# EAGLE design A10N_TOP (EAGLE 9.6.2)
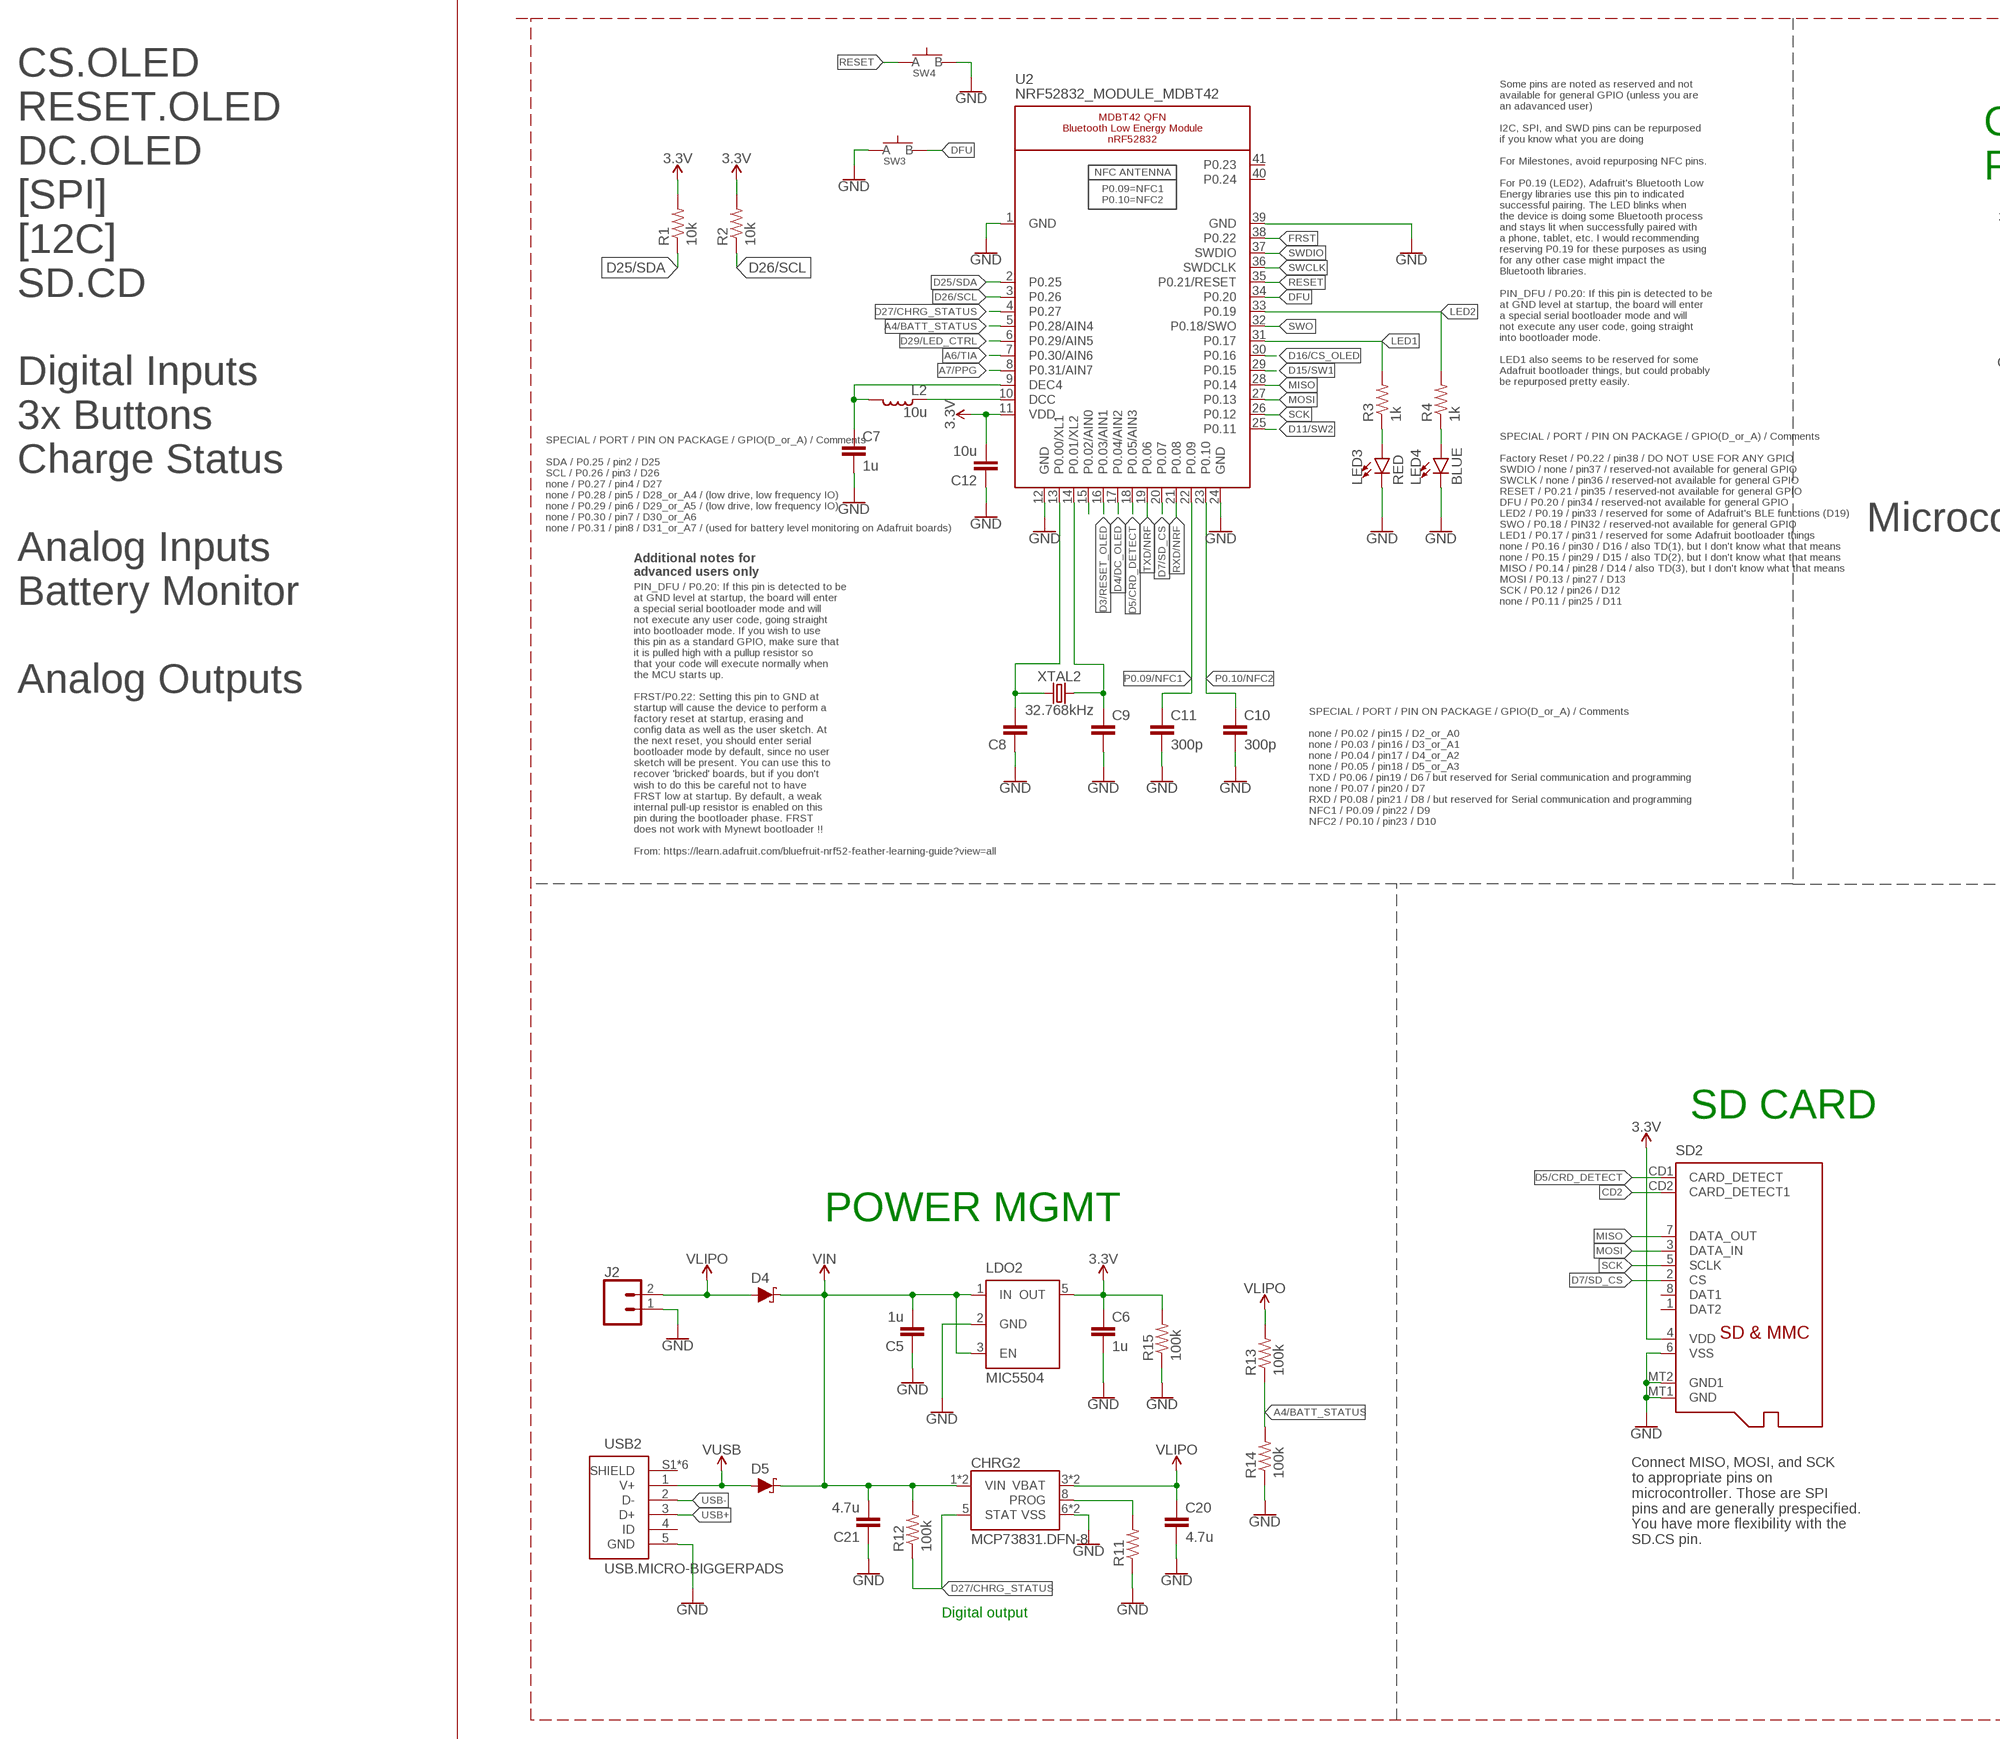
[diagram p0: schematic, sheet 1, part 1 of 2]
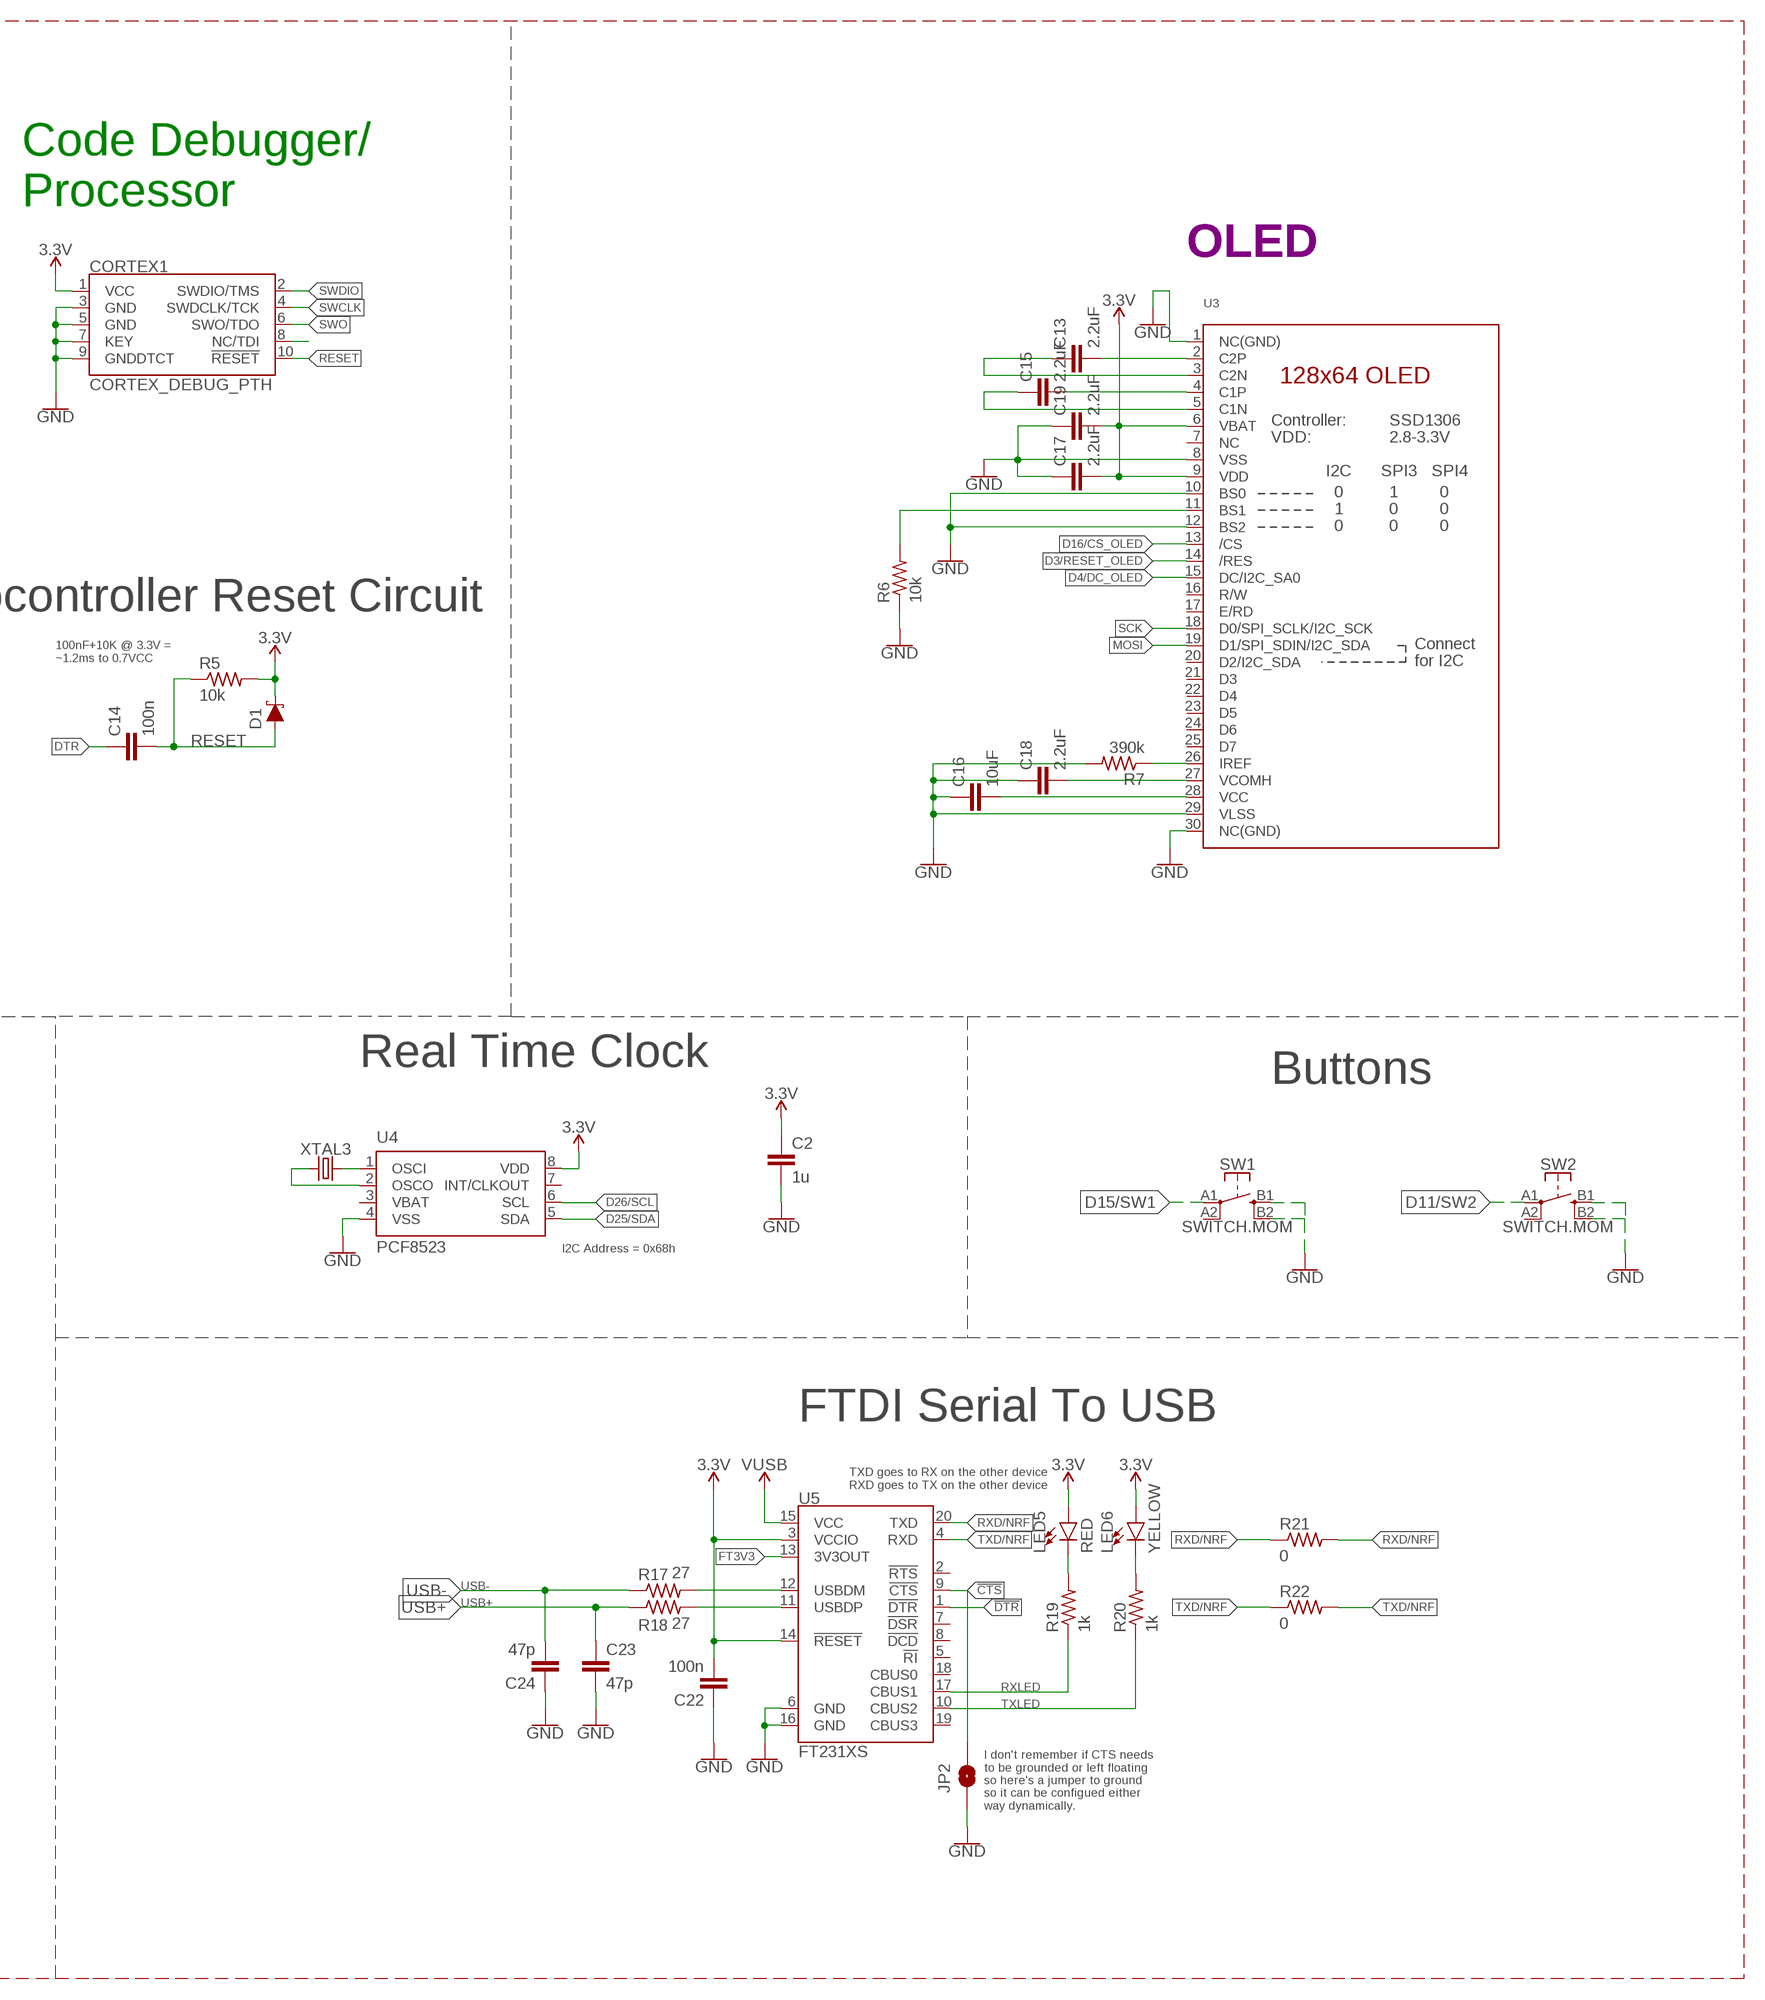
[diagram p1: schematic, sheet 1, part 2 of 2]

## Parts
C2  1u  CAPACITOR0603  [C0603]
C5  1u  CAPACITOR0603  [C0603]
C6  1u  CAPACITOR0603  [C0603]
C7  1u  CAPACITOR0603  [C0603]
C8  CAPACITOR0603  [C0603]
C9  CAPACITOR0603  [C0603]
C10  300p  CAPACITOR0603  [C0603]
C11  300p  CAPACITOR0603  [C0603]
C12  10u  CAPACITOR0805  [C0805]
C13  2.2uF  CAPACITOR0402  [C0402]
C14  100n  CAPACITOR0603  [C0603]
C15  2.2uF  CAPACITOR0402  [C0402]
C16  10uF  CAPACITOR0603  [C0603]
C17  2.2uF  CAPACITOR0402  [C0402]
C18  2.2uF  CAPACITOR0402  [C0402]
C19  2.2uF  CAPACITOR0402  [C0402]
C20  4.7u  CAPACITOR0603  [C0603]
C21  4.7u  CAPACITOR0603  [C0603]
C22  100n  CAPACITOR0603  [C0603]
C23  47p  CAPACITOR0603  [C0603]
C24  47p  CAPACITOR0603  [C0603]
CHRG2  MCP73831.DFN-8  [DFN-8-2X3MM]
CORTEX1  CORTEX_DEBUG_PTH  [2X5-PTH-1.27MM]
D1  SCHOTTKY-USC  [USC]
D4  SCHOTTKY-USC  [USC]
D5  SCHOTTKY-USC  [USC]
J2  CONN_02  [1X02]
JP2  JUMPER-SMT_2_NO_SILK  [SMT-JUMPER_2_NO_SILK]
L2  10u  INDUCTOR0603  [L0603]
LDO2  MIC5504  [SOT23-5@1]
LED3  RED  LED0603  [LED-0603]
LED4  BLUE  LED0603  [LED-0603]
LED5  RED  LED0603  [LED-0603]
LED6  YELLOW  LED0603  [LED-0603]
R1  10k  RESISTOR0603  [R0603]
R2  10k  RESISTOR0603  [R0603]
R3  1k  RESISTOR0603  [R0603]
R4  1k  RESISTOR0603  [R0603]
R5  10k  RESISTOR0603  [R0603]
R6  10k  RESISTOR0603  [R0603]
R7  390k  RESISTOR0603  [R0603]
R11  RESISTOR0603  [R0603]
R12  100k  RESISTOR0603  [R0603]
R13  100k  RESISTOR0603  [R0603]
R14  100k  RESISTOR0603  [R0603]
R15  100k  RESISTOR0603  [R0603]
R17  27  RESISTOR0603  [R0603]
R18  27  RESISTOR0603  [R0603]
R19  1k  RESISTOR0603  [R0603]
R20  1k  RESISTOR0603  [R0603]
R21  0  RESISTOR0603  [R0603]
R22  0  RESISTOR0603  [R0603]
SD2  MICROSD  [MICROSD]
SW1  SWITCH.MOM  [TACTILE_SWITCH_SMD_6.2MM_TALL]
SW2  SWITCH.MOM  [TACTILE_SWITCH_SMD_6.2MM_TALL]
SW3  SPST-PTS830GG140-COPY.1-3  [BUTTON-GULLWING]
SW4  SPST-PTS830GG140-COPY.1-3  [BUTTON-GULLWING]
U2  NRF52832_MODULE_MDBT42  [BLE_MODULE_RAYTAC_MDBT42]
U3  DISP_OLED_UG-2864HSWEG01-NO-WRAPAROUND  [UG-2864HSWEG01_0.96IN_NO-WRAPAROUND]
U4  PCF8523  [SO8]
U5  FT231XS  [SSOP20_L]
USB2  USB.MICRO-BIGGERPADS  [USB-MICRO-01.BIGGERPADS]
XTAL2  32.768kHz  CRYSTALECS-.327-12.5-12-C-TR  [2-SMD.NOLEAD.2.0MMTO1.2MM]
XTAL3  32.7680kHz  CRYSTALECS-.327-12.5-12-C-TR  [2-SMD.NOLEAD.2.0MMTO1.2MM]

## Nets
3.3V: C2.1 C6.1 C12.2 C17.2 C19.2 C22.2 CORTEX1.1(VCC) D1.-(C) LDO2.5(OUT) LED5.A LED6.A R1.2 R2.2 R5.2 R15.2 SD2.4(VDD) U2.11(VDD) U3.6(VBAT) U3.9(VDD) U4.8(VDD) U5.3(VCCIO) U5.14(!RESET)
!CTS: JP2.2 U5.9(!CTS)
!DTR: U5.1(!DTR)
A4/BATT_STATUS: R13.1 R14.2 U2.5(P0.28/AIN4)
A6/TIA: U2.7(P0.30/AIN6)
A7/PPG: U2.8(P0.31/AIN7)
CD2: SD2.CD2(CARD_DETECT1)
D3/RESET_OLED: U2.16(P0.03/AIN1) U3.14(/RES)
D4/DC_OLED: U2.17(P0.04/AIN2) U3.15(DC/I2C_SA0)
D5/CRD_DETECT: SD2.CD1(CARD_DETECT) U2.18(P0.05/AIN3)
D7/SD_CS: SD2.2(CS) U2.20(P0.07)
D11/SW2: SW2.A1 U2.25(P0.11)
D15/SW1: SW1.A1 U2.29(P0.15)
D16/CS_OLED: U2.30(P0.16) U3.13(/CS)
D25/SDA: R1.1 U2.2(P0.25) U4.5(SDA)
D26/SCL: R2.1 U2.3(P0.26) U4.6(SCL)
D27/CHRG_STATUS: CHRG2.5(STAT) R12.1 U2.4(P0.27)
D29/LED_CTRL: U2.6(P0.29/AIN5)
DFU: SW3.3(B) U2.34(P0.20)
DTR: C14.1
FRST: U2.38(P0.22)
FT3V3: U5.13(3V3OUT)
GND: C2.2 C5.1 C6.2 C7.2 C8.1 C9.2 C10.2 C11.2 C12.1 C16.1 C17.1 C18.1 C19.1 C20.2 C21.1 C22.1 C23.2 C24.1 CHRG2.6(VSS) CHRG2.EP(VSS) CORTEX1.3(GND) CORTEX1.5(GND) CORTEX1.7(KEY) CORTEX1.9(GNDDTCT) J2.1 JP2.1 LDO2.2(GND) LED3.C LED4.C R6.1 R7.2 R11.1 R14.1 R15.1 SD2.6(VSS) SD2.MT1(GND) SD2.MT2(GND1) SW1.B1 SW1.B2 SW2.B1 SW2.B2 SW3.1(A) SW4.3(B) U2.1(GND) U2.12(GND) U2.24(GND) U2.39(GND) U3.1(NC(GND)) U3.8(VSS) U3.10(BS0) U3.12(BS2) U3.29(VLSS) U3.30(NC(GND)) U4.4(VSS) U5.6(GND) U5.16(GND) USB2.5(GND)
LED1: R3.2 U2.31(P0.17)
LED2: R4.2 U2.33(P0.19)
MISO: SD2.7(DATA_OUT) U2.28(P0.14)
MOSI: SD2.3(DATA_IN) U2.27(P0.13) U3.19(D1/SPI_SDIN/I2C_SDA)
N$1: R6.2 U3.11(BS1)
N$2: R7.1 U3.26(IREF)
N$3: C13.2 U3.2(C2P)
N$4: C8.2 U2.13(P0.00/XL1) XTAL2.P$1
N$5: C13.1 U3.3(C2N)
N$6: C9.1 U2.14(P0.01/XL2) XTAL2.P$2
N$7: C15.2 U3.4(C1P)
N$8: C15.1 U3.5(C1N)
N$9: LED3.A R3.1
N$10: LED4.A R4.1
N$11: L2.1 U2.10(DCC)
N$12: C7.1 L2.2 U2.9(DEC4)
N$13: C16.2 U3.28(VCC)
N$14: CORTEX1.8(NC/TDI)
N$15: C18.2 U3.27(VCOMH)
N$16: R21.1
N$17: CHRG2.8(PROG) R11.2
N$18: R22.1
N$21: R21.2
N$22: R22.2
N$23: R17.2 U5.12(USBDM)
N$24: R18.2 U5.11(USBDP)
N$25: LED5.C R19.2
N$26: LED6.C R20.2
N$27: U2.15(P0.02/AIN0)
N$28: U4.2(OSCO) XTAL3.P$1
N$29: U4.1(OSCI) XTAL3.P$2
P0.09/NFC1: C11.1 U2.22(P0.09)
P0.10/NFC2: C10.1 U2.23(P0.10)
RESET: C14.2 CORTEX1.10(!RESET) D1.+(A) R5.1 SW4.1(A) U2.35(P0.21/RESET)
RXD/NRF: U2.21(P0.08) U5.20(TXD)
RXLED: R19.1 U5.17(CBUS1)
SCK: SD2.5(SCLK) U2.26(P0.12) U3.18(D0/SPI_SCLK/I2C_SCK)
SWCLK: CORTEX1.4(SWDCLK/TCK) U2.36(SWDCLK)
SWDIO: CORTEX1.2(SWDIO/TMS) U2.37(SWDIO)
SWO: CORTEX1.6(SWO/TDO) U2.32(P0.18/SWO)
TXD/NRF: U2.19(P0.06) U5.4(RXD)
TXLED: R20.1 U5.10(CBUS2)
USB+: C23.1 R18.1 USB2.3(D+)
USB-: C24.2 R17.1 USB2.2(D-)
V_USB: D5.+(A) U5.15(VCC) USB2.1(V+) ; supply symbol labelled VUSB
VIN: C5.2 C21.2 CHRG2.1(VIN) CHRG2.2(VIN) D4.-(C) D5.-(C) LDO2.1(IN) LDO2.3(EN) R12.2
VLIPO: C20.1 CHRG2.3(VBAT) CHRG2.4(VBAT) D4.+(A) J2.2 R13.2
Unconnected: SD2.1(DAT2) SD2.8(DAT1) SW1.A2 SW2.A2 U2.40(P0.24) U2.41(P0.23) U3.7(NC) U3.16(R/W) U3.17(E/RD) U3.20(D2/I2C_SDA) U3.21(D3) U3.22(D4) U3.23(D5) U3.24(D6) U3.25(D7) U4.7(INT/CLKOUT) U5.2(!RTS) U5.5(!RI) U5.7(!DSR) U5.8(!DCD) U5.18(CBUS0) U5.19(CBUS3) USB2.4(ID) USB2.S1(SHIELD) USB2.S2(SHIELD) USB2.S3(SHIELD) USB2.S4(SHIELD) USB2.S5(SHIELD) USB2.S6(SHIELD)

## Notes on the sheet
- Code Debugger/
  Processor
- OLED
- Some pins are noted as reserved and not
  available for general GPIO (unless you are
  an adavanced user)
  
  I2C, SPI, and SWD pins can be repurposed
  if you know what you are doing
  
  For Milestones, avoid repurposing NFC pins.
  
  For P0.19 (LED2), Adafruit's Bluetooth Low
  Energy libraries use this pin to indicated
  successful pairing. The LED blinks when
  the device is doing some Bluetooth process
  and stays lit when successfully paired with
  a phone, tablet, etc. I would recommending
  reserving P0.19 for these purposes as using
  for any other case might impact the
  Bluetooth libraries.
  
  PIN_DFU / P0.20: If this pin is detected to be
  at GND level at startup, the board will enter
  a special serial bootloader mode and will
  not execute any user code, going straight
  into bootloader mode.
  
  LED1 also seems to be reserved for some
  Adafruit bootloader things, but could probably
  be repurposed pretty easily.
- SPECIAL / PORT / PIN ON PACKAGE / GPIO(D_or_A) / Comments
  
  SDA / P0.25 / pin2 / D25
  SCL / P0.26 / pin3 / D26
  none / P0.27 / pin4 / D27
  none / P0.28 / pin5 / D28_or_A4 / (low drive, low frequency IO)
  none / P0.29 / pin6 / D29_or_A5 / (low drive, low frequency IO)
  none / P0.30 / pin7 / D30_or_A6
  none / P0.31 / pin8 / D31_or_A7 / (used for battery level monitoring on Adafruit boards)
- Microcontroller Reset Circuit
- Additional notes for
  advanced users only
- 100nF+10K @ 3.3V =
  ~1.2ms to 0.7VCC
- SPECIAL / PORT / PIN ON PACKAGE / GPIO(D_or_A) / Comments
  
  Factory Reset / P0.22 / pin38 / DO NOT USE FOR ANY GPIO
  SWDIO / none / pin37 / reserved-not available for general GPIO
  SWCLK / none / pin36 / reserved-not available for general GPIO
  RESET / P0.21 / pin35 / reserved-not available for general GPIO
  DFU / P0.20 / pin34 / reserved-not available for general GPIO
  LED2 / P0.19 / pin33 / reserved for some of Adafruit's BLE functions (D19)
  SWO / P0.18 / PIN32 / reserved-not available for general GPIO
  LED1 / P0.17 / pin31 / reserved for some Adafruit bootloader things
  none / P0.16 / pin30 / D16 / also TD(1), but I don't know what that means
  none / P0.15 / pin29 / D15 / also TD(2), but I don't know what that means
  MISO / P0.14 / pin28 / D14 / also TD(3), but I don't know what that means
  MOSI / P0.13 / pin27 / D13
  SCK / P0.12 / pin26 / D12
  none / P0.11 / pin25 / D11
- CS.OLED
  RESET.OLED
  DC.OLED
  [SPI]
  [12C]
  SD.CD
  
  Digital Inputs
  3x Buttons
  Charge Status
  
  Analog Inputs
  Battery Monitor
  
  Analog Outputs
- SPECIAL / PORT / PIN ON PACKAGE / GPIO(D_or_A) / Comments
  
  none / P0.02 / pin15 / D2_or_A0
  none / P0.03 / pin16 / D3_or_A1
  none / P0.04 / pin17 / D4_or_A2
  none / P0.05 / pin18 / D5_or_A3
  TXD / P0.06 / pin19 / D6 / but reserved for Serial communication and programming
  none / P0.07 / pin20 / D7
  RXD / P0.08 / pin21 / D8 / but reserved for Serial communication and programming
  NFC1 / P0.09 / pin22 / D9
  NFC2 / P0.10 / pin23 / D10
- PIN_DFU / P0.20: If this pin is detected to be
  at GND level at startup, the board will enter
  a special serial bootloader mode and will
  not execute any user code, going straight
  into bootloader mode. If you wish to use
  this pin as a standard GPIO, make sure that
  it is pulled high with a pullup resistor so
  that your code will execute normally when
  the MCU starts up.
  
  FRST/P0.22: Setting this pin to GND at
  startup will cause the device to perform a
  factory reset at startup, erasing and
  config data as well as the user sketch. At
  the next reset, you should enter serial
  bootloader mode by default, since no user
  sketch will be present. You can use this to
  recover 'bricked' boards, but if you don't
  wish to do this be careful not to have
  FRST low at startup. By default, a weak
  internal pull-up resistor is enabled on this
  pin during the bootloader phase. FRST
  does not work with Mynewt bootloader !!
  
  From: https://learn.adafruit.com/bluefruit-nrf52-feather-learning-guide?view=all
- Real Time Clock
- Buttons
- I2C Address = 0x68h
- SD CARD
- POWER MGMT
- FTDI Serial To USB
- TXD goes to RX on the other device
  RXD goes to TX on the other device
- Connect MISO, MOSI, and SCK
  to appropriate pins on
  microcontroller. Those are SPI
  pins and are generally prespecified.
  You have more flexibility with the
  SD.CS pin.
- I don't remember if CTS needs
  to be grounded or left floating
  so here's a jumper to ground
  so it can be configued either
  way dynamically.
- Digital output

## Power pins joined to a net without a drawn wire
VBAT: U4.3(VBAT)

## Library data of the parts
C2 C5-C24 = LinnesLab-Passives:CAPACITOR
CHRG2 = LinnesLab-Power:MCP73831
CORTEX1 = LinnesLab-Connectors:CORTEX_DEBUG: Cortex Debug Connector - 10 pin Supports JTAG debug, Serial Wire debug, and Serial Wire Viewer. PTH and SMD connector options available. General Connector Information <http://infocenter.arm.com/help/topic/com.arm.doc.faqs/attached/13634/cortex_debug_connectors.pdf> Products: PTH Connector <http://www.digikey.com/product-detail/en/cnc-tech/3220-10-0100-00/1175-1627-ND/3883661> -via Digi-Key SparkFun PSoc <https://www.sparkfun.com/products/13229> SparkFun T <https://www.sparkfun.com/products/13810>
D1 D4 D5 = LinnesLab-DiscreteSemi:SCHOTTKY: Schottky diode A Schottky diode is a semiconductor diode which has a low forward voltage drop and a very fast switching action. Example: Digi-Key Part Number: RB161MM-20CT-ND
J2 = LinnesLab-Connectors:CONN_02: Multi connection point. Often used as Generic Header-pin footprint for 0.1 inch spaced/style header connections On any of the 0.1 inch spaced packages, you can populate with these: Break Away Headers - Straight <https://www.sparkfun.com/products/116> (PRT-00116) Break Away Male Headers - Right Angle <https://www.sparkfun.com/products/553> (PRT-00553) Female Headers <https://www.sparkfun.com/products/115> (PRT-00115) Break Away Headers - Machine Pin <https://www.sparkfun.com/products/117> (PRT-00117) Break Away Female Headers - Swiss Machine Pin <https://www.sparkfun.com/products/743> (PRT-00743) For SCREWTERMINALS and SPRING TERMINALS visit here: Screw Terimnals on SparkFun.com <https://www.sparkfun.com/search/results?term=Screw+Terminals> (5mm/3.5mm/2.54mm spacing) This device is also useful as a general connection point to wire up your design to another part of your project. Our various solder wires solder well into these plated through hole pads. Hook-Up Wire - Assortment (Stranded, 22 AWG) <https://www.sparkfun.com/products/11375> (PRT-11375) Hook-Up Wire - Assortment (Solid Core, 22 AWG) <https://www.sparkfun.com/products/11367> (PRT-11367) View the entire wire category on our website here <https://www.sparkfun.com/categories/141> Special notes: Molex polarized connector foot print use with: PRT-08233 with associated crimp pins and housings. 2.54_SCREWTERM for use with PRT-10571. 3.5mm Screw Terminal footprints for PRT-08084 5mm Screw Terminal footprints for use with PRT-08432
JP2 = LinnesLab-Switches:JUMPER-SMT_2_NO: Normally open jumper This jumper has two pads in close proximity to each other. Apply solder to close the connection. Round pads are easier to solder for beginners, but are a lot larger. SparkFun Product that uses the round pads: SparkFun EL Sequencer <https://www.sparkfun.com/products/12781>
L2 = LinnesLab-Passives:INDUCTOR
LDO2 = LinnesLab-Power:MIC5504: MIC5504 Voltage Regulator Output Voltages: 1.0V to 3.3V Input Voltages: 2.5V to 5.5V Link to Datasheet http://ww1.microchip.com/downloads/en/DeviceDoc/MIC550X.pdf
LED3-LED6 = LinnesLab-LED:LED: LED (Generic) Standard schematic elements and footprints for 5mm, 3mm, 1206, and 0603 sized LEDs. Generic LEDs with no color specified. LTST-C190KGKT: arrow indicates cathode
R1-R7 R11-R15 R17-R22 = LinnesLab-Passives:RESISTOR
SD2 = LinnesLab-Connectors:MICROSD: Micro-SD / Transflash card holder with SPI pinout For the 3M # 2908-05WB-MG and/or 4UCON #19656 push-push type
SW1 SW2 = LinnesLab-Switches:SWITCH.MOM: PTS645SM43SMTR92 LFS
SW3 SW4 = LinnesLab-Switches:SPST-PTS830GG140-COPY
U2 = LinnesLab-Microcontrollers:NRF52832_MODULE_MDBT42: MDBT42 - BLE Module (nRF52832 QFN) VDD: 1.7-3.6V
U3 = LinnesLab-Displays:DISP_OLED_UG-2864HSWEG01: UG-2864HSWEG01 OLED display Both 1.3" and 0.96" models share the same FPC tab footprint, only the screen dimensions vary.
U4 = LinnesLab-Clocks:PCF8523; DIGIKEY: 568-5306-1-ND; I2C_ADDRESS: 0x68h; MFN: PCF8523T/1,118; MFN_MANUFACTURER: NXP USA Inc.
U5 = LinnesLab-DigitalIC:FT231X: FTDI FT231X Full Speed USB to Full-handshake UART This USB2.0 Full Speed IC offers a compact bridge to full handshake UART interfaces. The device is a UART, capable of operating up to 3MBaud, with low power consumption (8mA). The FT231X includes the complete FT-X series feature set and enables USB to be added into a system design quickly and easily over a UART interface. Datasheet <http://cdn.sparkfun.com/datasheets/Components/General%20IC/DS_FT231X.pdf>; DIGIKEY: 768-1156-5-ND; MFN: FT231XS-U
USB2 = LinnesLab-Connectors:USB.MICRO: DigiKey PN: 609-4613-1-ND
XTAL2 XTAL3 = LinnesLab-Clocks:CRYSTAL; DIGIKEY: XC2288CT-ND; FREQ: 32.7680KHZ; LOAD_CAP: 12.5pF

## Net classes
1 power: width 0.254 mm

## Board
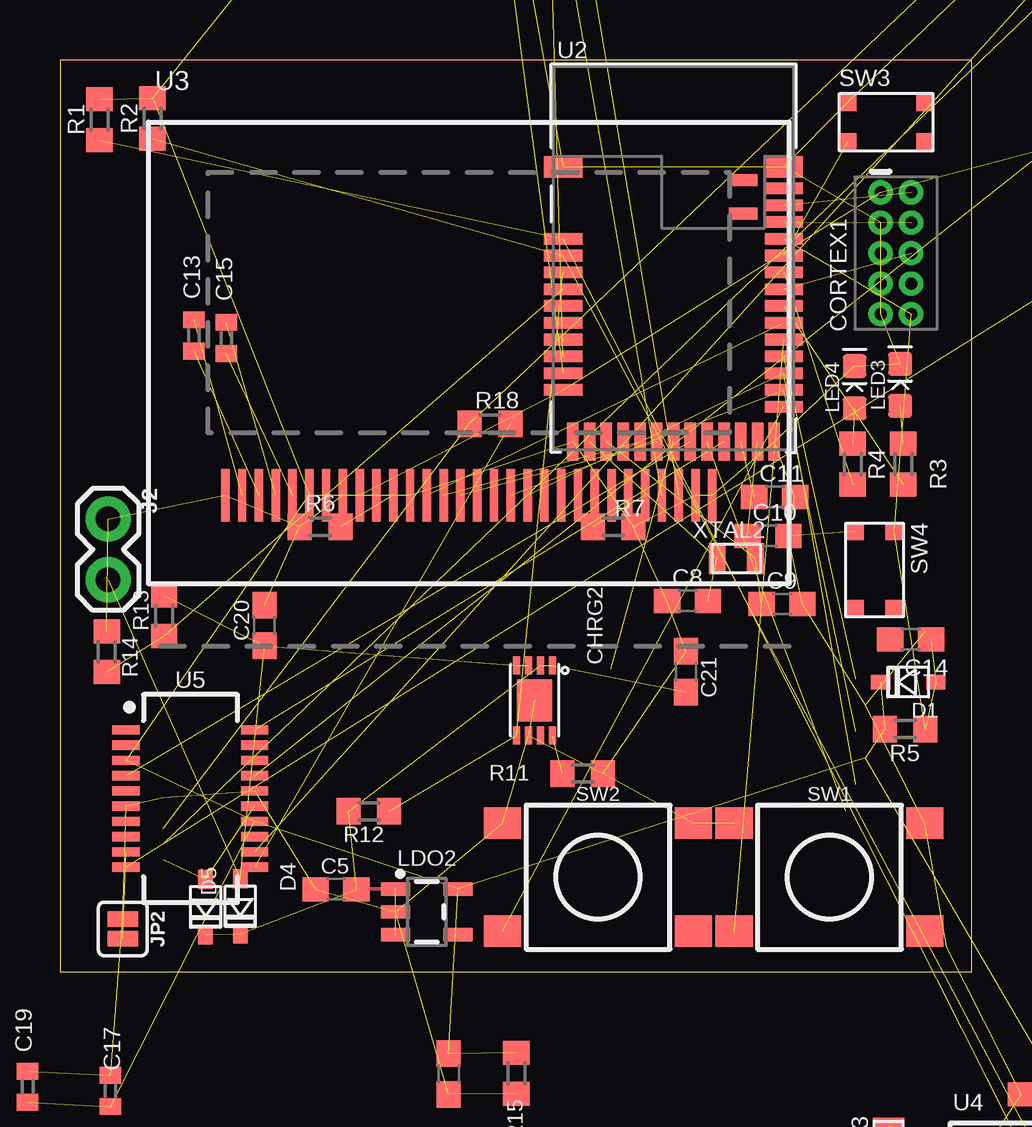
[diagram p2: board, top side]
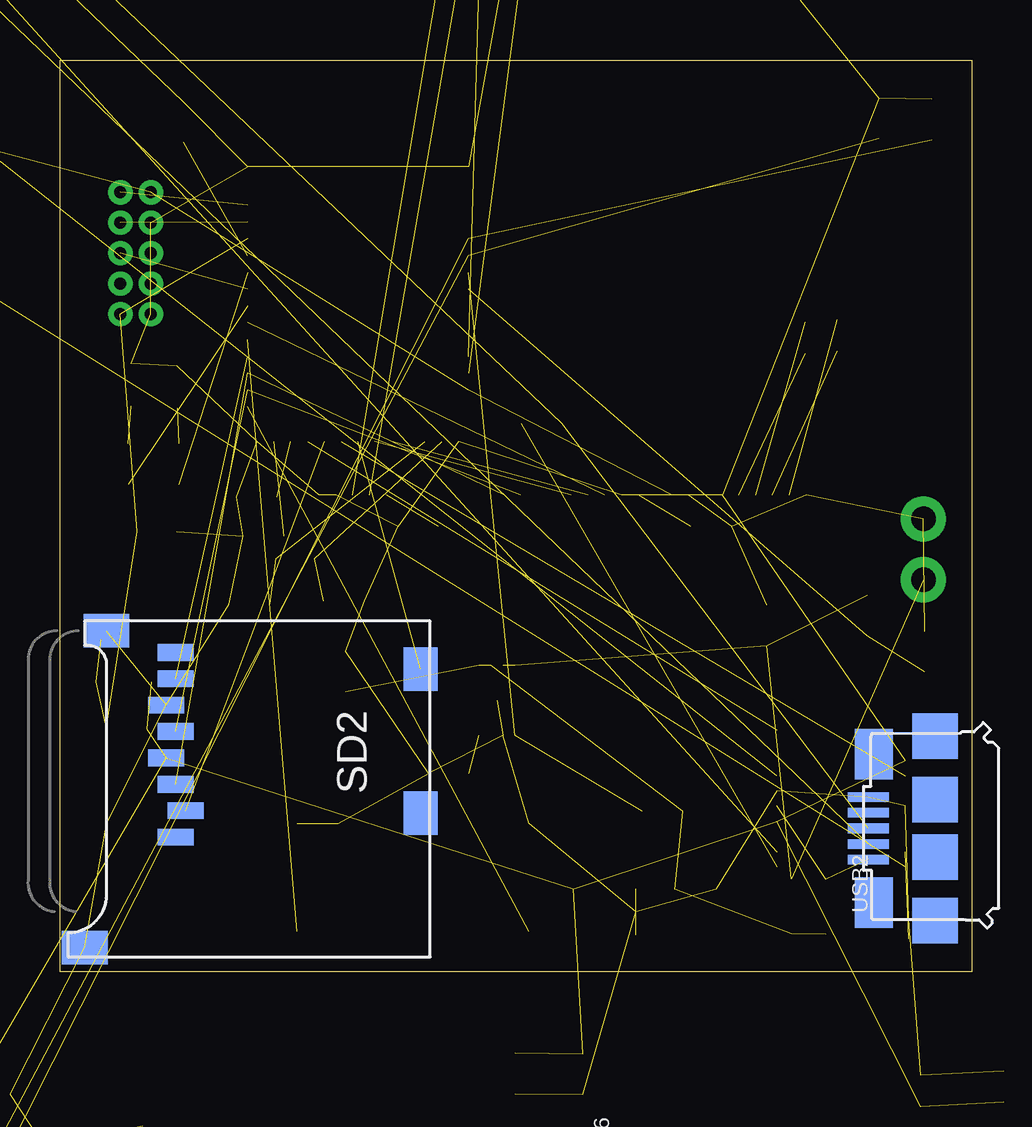
[diagram p3: board, bottom side, seen from below]

Size 38 x 38 mm. Coordinates in mm from the lower left corner, seen from the top.
Outline: 0,0 38,0 38,38 0,38 0,0
Copper layers (1*16): Top 0.035mm / dielectric 1.5mm / Bottom 0.035mm
Design rules "default": minimum track width 6mil, minimum drill 0.35mm, track to track 6mil, track to pad 6mil, pad to pad 6mil, via to via 6mil, smd to smd 6mil, copper to edge 40mil, drill to drill 6mil, minimum pad ring 10mil, minimum via ring 8mil, stop-mask expansion 4mil, vias tented up to drill 0mil, thermal gap 10mil

### Footprints (pad centres in the part's own frame; a part is rotated, then mirrored left to right if it is on the bottom)
C0603 = smd 1.1 x 1: 1 -0.85,0; 2 0.85,0
C0805 = smd 1.3 x 1.5: 1 -0.95,0; 2 0.95,0
C0402 = smd 0.7 x 0.9: 1 -0.65,0; 2 0.65,0
DFN-8-2X3MM = smd 0.3 x 0.75: 1 -0.75,-1.45; 2 -0.25,-1.45; 3 0.25,-1.45; 4 0.75,-1.45; 5 0.75,1.45; 6 0.25,1.45; 7 -0.25,1.45; 8 -0.75,1.45 | smd 1.45 x 1.75: EP 0,0
2X5-PTH-1.27MM = drill 0.508 pad 1: 1 -2.54,-0.635; 2 -2.54,0.635; 3 -1.27,-0.635; 4 -1.27,0.635; 5 0,-0.635; 6 0,0.635; 7 1.27,-0.635; 8 1.27,0.635; 9 2.54,-0.635; 10 2.54,0.635
USC = smd 0.8 x 0.6: + -1.15,0; - 1.15,0
1X02 = drill 1.016 pad 1.88: 1 0,0; 2 2.54,0
SMT-JUMPER_2_NO_SILK = smd 0.635 x 1.27: 1 -0.406,0; 2 0.406,0
L0603 = smd 1 x 1.1: 1 -0.85,0; 2 0.85,0
SOT23-5@1 = smd 0.55 x 1.2: 1 -0.95,-1.3; 2 0,-1.3; 3 0.95,-1.3; 4 0.95,1.3; 5 -0.95,1.3
LED-0603 = smd 1 x 1: A -0.877,0; C 0.877,0
R0603 = smd 1 x 1.1: 1 -0.85,0; 2 0.85,0
MICROSD = smd 0.7 x 1.5: 1 9,-10.64; 2 7.9,-10.24; 3 6.8,-10.64; 4 5.7,-11.04; 5 4.6,-10.64; 6 3.5,-11.04; 7 2.4,-10.64; 8 1.3,-10.64 | smd 1.8 x 1.4: CD1 2,-0.44; CD2 8,-0.44 | smd 1.4 x 1.9: MT1 0.4,-13.54; MT2 13.6,-14.44
TACTILE_SWITCH_SMD_6.2MM_TALL = smd 1.55 x 1.3: A1 -3.975,-2.25; A2 3.975,-2.25; B1 -3.975,2.25; B2 3.975,2.25
BUTTON-GULLWING = smd 0.7 x 0.75: 1 -1.6,0.825; 2 1.6,0.825; 3 -1.6,-0.825; 4 1.6,-0.825
BLE_MODULE_RAYTAC_MDBT42 = smd 1.6 x 0.9: 1 -4.6,3.8; 39 4.6,3.8 | smd 1.6 x 0.48: 2 -4.6,0.8; 3 -4.6,0.1; 4 -4.6,-0.6; 5 -4.6,-1.3; 6 -4.6,-2; 7 -4.6,-2.7; 8 -4.6,-3.4; 9 -4.6,-4.1; 10 -4.6,-4.8; 11 -4.6,-5.5; 25 4.6,-6.2; 26 4.6,-5.5; 27 4.6,-4.8; 28 4.6,-4.1; 29 4.6,-3.4; 30 4.6,-2.7; 31 4.6,-2; 32 4.6,-1.3; 33 4.6,-0.6; 34 4.6,0.1; 35 4.6,0.8; 36 4.6,1.5; 37 4.6,2.2; 38 4.6,2.9 | smd 0.48 x 1.6: 12 -4.2,-7.65; 13 -3.5,-7.65; 14 -2.8,-7.65; 15 -2.1,-7.65; 16 -1.4,-7.65; 17 -0.7,-7.65; 18 0,-7.65; 19 0.7,-7.65; 20 1.4,-7.65; 21 2.1,-7.65; 22 2.8,-7.65; 23 3.5,-7.65; 24 4.2,-7.65 | smd 1.2 x 0.5: 40 2.9,3.25; 41 2.9,1.85
UG-2864HSWEG01_0.96IN_NO-WRAPAROUND = smd 0.35 x 2.2: 1 -10.15,-1.2; 2 -9.45,-1.2; 3 -8.75,-1.2; 4 -8.05,-1.2; 5 -7.35,-1.2; 6 -6.65,-1.2; 7 -5.95,-1.2; 8 -5.25,-1.2; 9 -4.55,-1.2; 10 -3.85,-1.2; 11 -3.15,-1.2; 12 -2.45,-1.2; 13 -1.75,-1.2; 14 -1.05,-1.2; 15 -0.35,-1.2; 16 0.35,-1.2; 17 1.05,-1.2; 18 1.75,-1.2; 19 2.45,-1.2; 20 3.15,-1.2; 21 3.85,-1.2; 22 4.55,-1.2; 23 5.25,-1.2; 24 5.95,-1.2; 25 6.65,-1.2; 26 7.35,-1.2; 27 8.05,-1.2; 28 8.75,-1.2; 29 9.45,-1.2; 30 10.15,-1.2
SO8 = smd 1.3 x 0.6: 1 -2.65,1.905; 2 -2.65,0.635; 3 -2.65,-0.635; 4 -2.65,-1.905; 5 2.65,-1.905; 6 2.65,-0.635; 7 2.65,0.635; 8 2.65,1.905
SSOP20_L = smd 0.381 x 1.143: 1 -2.857,-2.68; 2 -2.223,-2.68; 3 -1.587,-2.68; 4 -0.953,-2.68; 5 -0.318,-2.68; 6 0.318,-2.68; 7 0.953,-2.68; 8 1.587,-2.68; 9 2.223,-2.68; 10 2.857,-2.68; 11 2.857,2.68; 12 2.223,2.68; 13 1.587,2.68; 14 0.953,2.68; 15 0.318,2.68; 16 -0.318,2.68; 17 -0.953,2.68; 18 -1.587,2.68; 19 -2.223,2.68; 20 -2.857,2.68
USB-MICRO-01.BIGGERPADS = smd 0.4 x 1.7: 1 -1.3,1.505; 2 -0.65,1.505; 3 0,1.505; 4 0.65,1.505; 5 1.3,1.505 | smd 1.9 x 1.9: S1 -3.85,-1.27; S2 -1.2,-1.27; S3 1.2,-1.27; S4 3.85,-1.27 | smd 2.1 x 1.6: S5 -3.1,1.28; S6 3.1,1.28
2-SMD.NOLEAD.2.0MMTO1.2MM = smd 0.7 x 1.3: P$1 -0.8,0; P$2 0.8,0

### Placement (x,y rotation side)
C2  40.92,-5.11 180 top  (outside the outline)
C5  11.51,3.43 0 top
C6  16.21,-4.27 270 top  (outside the outline)
C7  19.53,46.28 180 top  (outside the outline)
C8  26.16,15.44 0 top
C9  30.1,15.32 0 top
C10  29.51,18.16 0 top
C11  29.79,19.79 0 top
C12  17.58,52.35 180 top  (outside the outline)
C13  5.59,26.52 90 top
C14  35.46,13.84 0 top
C15  6.93,26.42 90 top
C16  19.96,49.71 0 top  (outside the outline)
C17  2.11,-4.98 270 top  (outside the outline)
C18  19.51,48.44 0 top  (outside the outline)
C19  -1.35,-4.8 270 top  (outside the outline)
C20  8.53,14.43 90 top
C21  26.09,12.5 270 top
C22  47.07,53.92 0 top  (outside the outline)
C23  47.07,52.12 180 top  (outside the outline)
C24  47.02,48.97 0 top  (outside the outline)
CHRG2  19.79,11.3 180 top
CORTEX1  34.85,29.95 270 top
D1  35.36,12.06 180 top
D4  7.52,2.72 270 top
D5  6.07,2.69 270 top
J2  2.01,18.87 270 top
JP2  2.62,1.78 270 top
L2  17.75,42.95 180 top  (outside the outline)
LDO2  15.29,2.49 270 top
LED3  35.03,24.46 90 top
LED4  33.12,24.36 90 top
LED5  52.15,39.75 0 top  (outside the outline)
LED6  52.12,37.01 0 top  (outside the outline)
R1  1.65,35.51 90 top
R2  3.86,35.56 90 top
R3  35.15,21.16 270 top
R4  33.05,21.16 270 top
R5  35.23,10.11 180 top
R6  10.85,18.54 0 top
R7  23.06,18.54 0 top
R11  21.79,8.26 180 top
R12  12.88,6.68 180 top
R13  4.34,14.83 90 top
R14  1.96,13.34 270 top
R15  19.02,-4.24 90 top  (outside the outline)
R17  46.96,47.04 180 top  (outside the outline)
R18  17.93,22.83 0 top
R19  52.3,42.44 0 top  (outside the outline)
R20  52.07,34.62 0 top  (outside the outline)
R21  -1.27,-10.46 0 top  (outside the outline)
R22  -1.27,-13.16 0 top  (outside the outline)
SD2  22.53,14.61 270 bottom
SW1  32.08,3.94 0 top
SW2  22.43,3.94 0 top
SW3  34.44,35.41 0 top
SW4  33.96,16.74 270 top
U2  25.58,29.74 0 top
U3  17.04,21.06 0 top
U4  39.12,-8.71 0 top  (outside the outline)
U5  5.44,7.21 270 top
USB2  2.79,5.97 90 bottom
XTAL2  28.19,17.22 0 top
XTAL3  34.54,-7.24 90 top  (outside the outline)

### Tracks (layer width: path | path; a pad name or v marks a point on that pad's centre or on a via)
3.3V  (21 unrouted)
!CTS  (1 unrouted)
A4/BATT_STATUS  (2 unrouted)
D3/RESET_OLED  (1 unrouted)
D4/DC_OLED  (1 unrouted)
D5/CRD_DETECT  (1 unrouted)
D7/SD_CS  (1 unrouted)
D11/SW2  (1 unrouted)
D15/SW1  (1 unrouted)
D16/CS_OLED  (1 unrouted)
D25/SDA  (2 unrouted)
D26/SCL  (2 unrouted)
D27/CHRG_STATUS  (2 unrouted)
DFU  (1 unrouted)
GND  (56 unrouted)
LED1  (1 unrouted)
LED2  (1 unrouted)
MISO  (1 unrouted)
MOSI  (2 unrouted)
N$1  (1 unrouted)
N$2  (1 unrouted)
N$3  (1 unrouted)
N$4  (2 unrouted)
N$5  (1 unrouted)
N$6  (2 unrouted)
N$7  (1 unrouted)
N$8  (1 unrouted)
N$9  (1 unrouted)
N$10  (1 unrouted)
N$11  (1 unrouted)
N$12  (2 unrouted)
N$13  (1 unrouted)
N$15  (1 unrouted)
N$17  (1 unrouted)
N$23  (1 unrouted)
N$24  (1 unrouted)
N$25  (1 unrouted)
N$26  (1 unrouted)
N$28  (1 unrouted)
N$29  (1 unrouted)
P0.09/NFC1  (1 unrouted)
P0.10/NFC2  (1 unrouted)
RESET  (5 unrouted)
RXD/NRF  (1 unrouted)
RXLED  (1 unrouted)
SCK  (2 unrouted)
SWCLK  (1 unrouted)
SWDIO  (1 unrouted)
SWO  (1 unrouted)
TXD/NRF  (1 unrouted)
TXLED  (1 unrouted)
USB+  (2 unrouted)
USB-  (2 unrouted)
V_USB  (2 unrouted)
VIN  (7 unrouted)
  Top 0.152: LDO2.1 C5.2
VLIPO  (5 unrouted)